# EAGLE design adsr2_v2 (EAGLE 7.1.0)
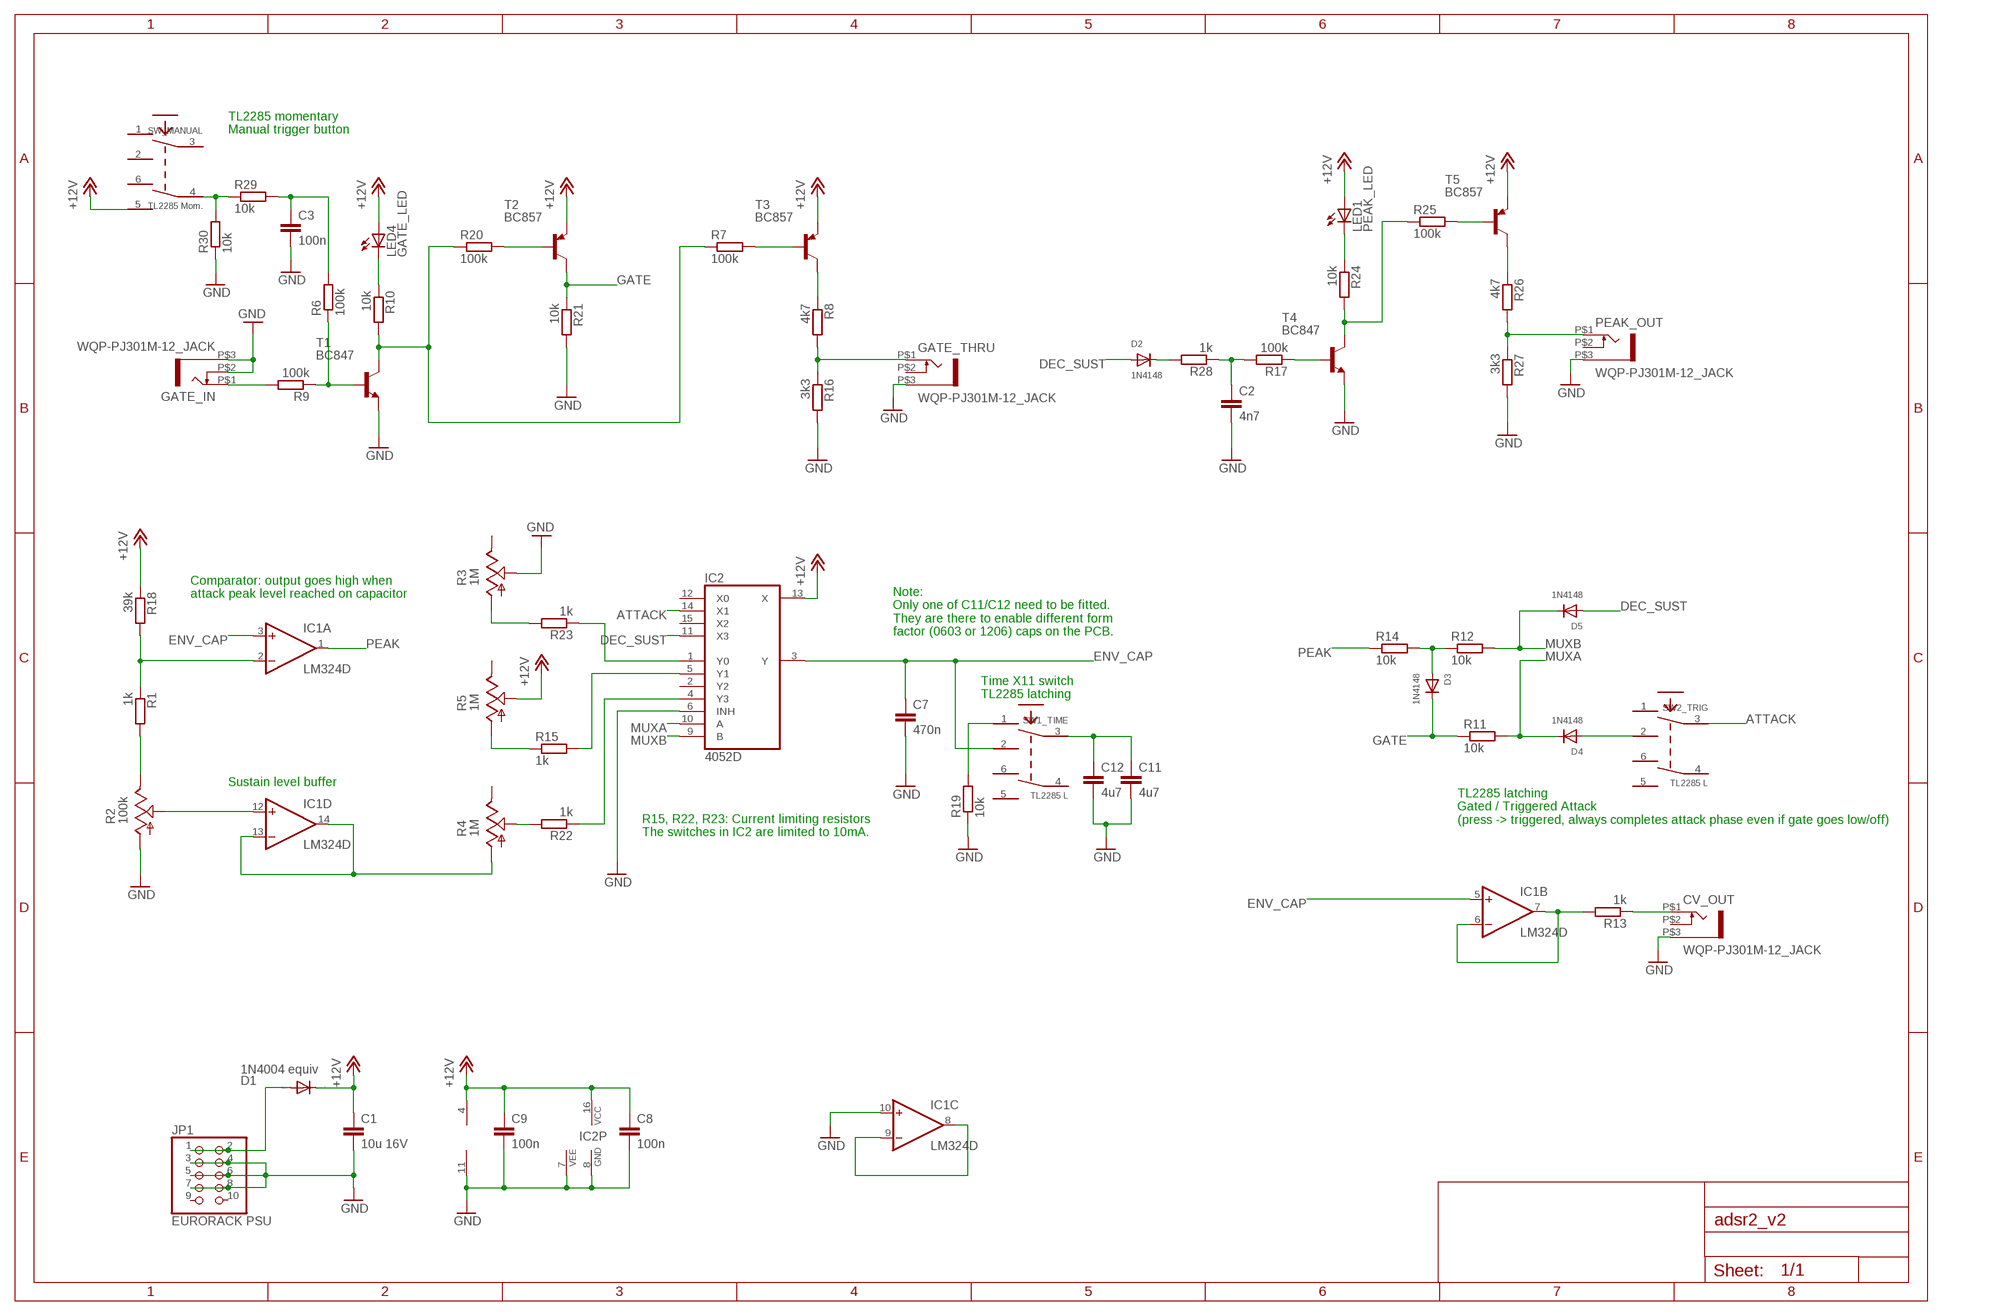
[diagram p0: schematic, sheet 1]

## Parts
C1  10u 16V  C-EUC1206K  [C1206K]
C2  4n7  C-EUC0603K  [C0603K]
C3  100n  C-EUC0603K  [C0603K]
C7  470n  C-EUC0603K  [C0603K]
C8  100n  C-EUC0603K  [C0603K]
C9  100n  C-EUC0603K  [C0603K]
C11  4u7  C-EUC1206K  [C1206K]
C12  4u7  C-EUC0603K  [C0603K]
CV_OUT  WQP-PJ301M-12_JACK  [WQP-PJ301M-12_JACK]
D1  1N4004 equiv  DIODE-DO214AA  [DO214AA]
D2  1N4148  DIODESOD-323F  [SOD-323F]
D3  1N4148  DIODESOD-323F  [SOD-323F]
D4  1N4148  DIODESOD-323F  [SOD-323F]
D5  1N4148  DIODESOD-323F  [SOD-323F]
GATE_IN  WQP-PJ301M-12_JACK  [WQP-PJ301M-12_JACK]
GATE_THRU  WQP-PJ301M-12_JACK  [WQP-PJ301M-12_JACK]
IC1  LM324D  [SO14]
IC2  4052D  [SO16]
JP1  EURORACK PSU  PINHD-2X5  [2X05]
LED1  PEAK_LED  LED5MM  [LED5MM]
LED4  GATE_LED  LED5MM  [LED5MM]
PEAK_OUT  WQP-PJ301M-12_JACK  [WQP-PJ301M-12_JACK]
R1  1k  R-EU_R0603  [R0603]
R2  100k  POT_USVERTICAL  [ALPS_POT_VERTICAL]
R3  1M  POT_USVERTICAL  [ALPS_POT_VERTICAL]
R4  1M  POT_USVERTICAL  [ALPS_POT_VERTICAL]
R5  1M  POT_USVERTICAL  [ALPS_POT_VERTICAL]
R6  100k  R-EU_R0603  [R0603]
R7  100k  R-EU_R0603  [R0603]
R8  4k7  R-EU_R0603  [R0603]
R9  100k  R-EU_R0603  [R0603]
R10  10k  R-EU_R0603  [R0603]
R11  10k  R-EU_R0603  [R0603]
R12  10k  R-EU_R0603  [R0603]
R13  1k  R-EU_R0603  [R0603]
R14  10k  R-EU_R0603  [R0603]
R15  1k  R-EU_R0603  [R0603]
R16  3k3  R-EU_R0603  [R0603]
R17  100k  R-EU_R0603  [R0603]
R18  39k  R-EU_R0603  [R0603]
R19  10k  R-EU_R0603  [R0603]
R20  100k  R-EU_R0603  [R0603]
R21  10k  R-EU_R0603  [R0603]
R22  1k  R-EU_R0603  [R0603]
R23  1k  R-EU_R0603  [R0603]
R24  10k  R-EU_R0603  [R0603]
R25  100k  R-EU_R0603  [R0603]
R26  4k7  R-EU_R0603  [R0603]
R27  3k3  R-EU_R0603  [R0603]
R28  1k  R-EU_R0603  [R0603]
R29  10k  R-EU_R0603  [R0603]
R30  10k  R-EU_R0603  [R0603]
SW1_TIME  TL2285 L  TL2285  [TL2285_PCB]
SW2_TRIG  TL2285 L  TL2285  [TL2285_PCB]
SW_MANUAL  TL2285 Mom.  TL2285  [TL2285_PCB]
T1  BC847  [SOT23]
T2  BC857  BC857A-PNP-SOT23-BEC  [SOT23-BEC]
T3  BC857  BC857A-PNP-SOT23-BEC  [SOT23-BEC]
T4  BC847  [SOT23]
T5  BC857  BC857A-PNP-SOT23-BEC  [SOT23-BEC]

## Nets
+12V: C1.1 C8.1 C9.1 D1.C IC1.4(P:V+) IC2.13(X) IC2.16(VCC) LED1.A LED4.A R5.P$2(S) R18.1 SW_MANUAL.5 T2.E T3.E T5.E
ATTACK: IC2.14(X1) SW2_TRIG.3
ATTACK_REF: IC1.2(A:-IN) R1.1 R18.2
DEC_SUST: D2.A D5.A IC2.11(X3)
ENV_CAP: C7.1 IC1.3(A:+IN) IC1.5(B:+IN) IC2.3(Y) SW1_TIME.2
GATE: D3.C R11.1 R21.1 T2.C
GATE_IN: R7.1 R10.2 R20.1 T1.3(C)
GND: C1.2 C2.2 C3.2 C7.2 C8.2 C9.2 C11.2 C12.2 CV_OUT.P$3 GATE_IN.P$2 GATE_IN.P$3 GATE_THRU.P$3 IC1.10(C:+IN) IC1.11(P:V-) IC2.6(INH) IC2.7(VEE) IC2.8(GND) JP1.3 JP1.4 JP1.5 JP1.6 JP1.7 JP1.8 PEAK_OUT.P$3 R2.P$3(A) R3.P$2(S) R16.2 R19.1 R21.2 R27.2 R30.1 T1.2(E) T4.2(E)
MUXA: D4.C IC2.10(A) R11.2
MUXB: D5.C IC2.9(B) R12.2
N$1: R20.2 T2.B
N$2: GATE_IN.P$1 R9.2
N$3: D1.A JP1.1 JP1.2
N$4: R29.1 R30.2 SW_MANUAL.4
N$5: IC2.1(Y0) R23.1
N$6: IC2.4(Y3) R22.1
N$7: IC1.13(D:-IN) IC1.14(D:OUT) R4.P$3(A)
N$8: R7.2 T3.B
N$9: R8.1 T3.C
N$10: IC2.5(Y1) R15.2
N$11: CV_OUT.P$1 R13.1
N$12: IC1.6(B:-IN) IC1.7(B:OUT) R13.2
N$13: GATE_THRU.P$1 R8.2 R16.1
N$14: D2.C R28.2
N$15: C3.1 R6.2 R29.2
N$16: C11.1 C12.1 SW1_TIME.3
N$17: D3.A R12.1 R14.2
N$18: R19.2 SW1_TIME.1
N$19: R17.1 T4.1(B)
N$20: C2.1 R17.2 R28.1
N$21: R6.1 R9.1 T1.1(B)
N$22: LED4.K(C) R10.1
N$23: R3.P$3(A) R23.2
N$24: IC1.8(C:OUT) IC1.9(C:-IN)
N$25: R5.P$3(A) R15.1
N$26: R1.2 R2.P$1(E)
N$27: D4.A SW2_TRIG.2
N$28: R4.P$2(S) R22.2
N$30: R24.2 R25.1 T4.3(C)
N$31: LED1.K(C) R24.1
N$33: R25.2 T5.B
N$34: R26.1 T5.C
N$35: PEAK_OUT.P$1 R26.2 R27.1
PEAK: IC1.1(A:OUT) R14.1
SUST_LEVEL: IC1.12(D:+IN) R2.P$2(S)
Unconnected: CV_OUT.P$2 GATE_THRU.P$2 IC2.2(Y2) IC2.12(X0) IC2.15(X2) JP1.9 JP1.10 PEAK_OUT.P$2 R3.P$1(E) R4.P$1(E) R5.P$1(E) SW1_TIME.4 SW1_TIME.5 SW1_TIME.6 SW2_TRIG.1 SW2_TRIG.4 SW2_TRIG.5 SW2_TRIG.6 SW_MANUAL.1 SW_MANUAL.2 SW_MANUAL.3 SW_MANUAL.6

## Notes on the sheet
- TL2285 momentary
  Manual trigger button
- Comparator: output goes high when
  attack peak level reached on capacitor
- Note:
  Only one of C11/C12 need to be fitted.
  They are there to enable different form
  factor (0603 or 1206) caps on the PCB.
- Time X11 switch
  TL2285 latching
- Sustain level buffer
- TL2285 latching
  Gated / Triggered Attack
  (press -> triggered, always completes attack phase even if gate goes low/off)
- R15, R22, R23: Current limiting resistors
  The switches in IC2 are limited to 10mA.

## Library data of the parts
C1-C3 C7-C9 C11 C12 = rcl:C-EU: CAPACITOR, European symbol
CV_OUT GATE_IN GATE_THRU PEAK_OUT = thonkiconn:WQP-PJ301M-12_JACK
D1 = diode:DIODE-: DIODE
D2-D5 = adafruit:DIODE: Diode SMADIODE - SMA Surface Mount Package 20V 1A Schottky Diode Digikey: 641-1014-6-ND DO-1N4148 - Through Hole Small Current Diode SOD-123 20V 1 A (.5mV Vf) Schottky Diode - Digikey: MBRX120TPMSCT-ND SOD-323 10V 570mA (.38mV Vf, 3ns) Schottky Diode - Digikey: ZLLS410CT-ND SOD-523 30V 30mA Schottky Diode (RB751S-40TE61) - Digikey: RB751S-40TE61CT-ND SOT23-R/W - SOT23 Package (R = Solder Paste/Reflow Ovens, W = Hand-Soldering) BAT54Film 40V 300mA - Digikey: 497-7162-1-ND
IC1 = linear:LM324: OP AMP
IC2 = 40xx:4052: Dual 4-channel ANALOG MULTIPLEXER
JP1 = pinhead:PINHD-2X5: PIN HEADER
LED1 LED4 = led:LED: LED OSRAM: - CHIPLED LG R971, LG N971, LY N971, LG Q971, LY Q971, LO R971, LY R971 LH N974, LH R974 LS Q976, LO Q976, LY Q976 LO Q996 - Hyper CHIPLED LW Q18S LB Q993, LB Q99A, LB R99A - SideLED LS A670, LO A670, LY A670, LG A670, LP A670 LB A673, LV A673, LT A673, LW A673 LH A674 LY A675 LS A676, LA A676, LO A676, LY A676, LW A676 LS A679, LY A679, LG A679 - Hyper Micro SIDELED® LS Y876, LA Y876, LO Y876, LY Y876 LT Y87S - SmartLED LW L88C, LW L88S LB L89C, LB L89S, LG L890 LS L89K, LO L89K, LY L89K LS L896, LA L896, LO L896, LY L896 - TOPLED LS T670, LO T670, LY T670, LG T670, LP T670 LSG T670, LSP T670, LSY T670, LOP T670, LYG T670 LG T671, LOG T671, LSG T671 LB T673, LV T673, LT T673, LW T673 LH T674 LS T676, LA T676, LO T676, LY T676, LB T676, LH T676, LSB T676, LW T676 LB T67C, LV T67C, LT T67C, LS T67K, LO T67K, LY T67K, LW E67C LS E67B, LA E67B, LO E67B, LY E67B, LB E67C, LV E67C, LT E67C LW T67C LS T679, LY T679, LG T679 LS T770, LO T770, LY T770, LG T770, LP T770 LB T773, LV T773, LT T773, LW T773 LH T774 LS E675, LA E675, LY E675, LS T675 LS T776, LA T776, LO T776, LY T776, LB T776 LHGB T686 LT T68C, LB T68C - Hyper Mini TOPLED® LB M676 - Mini TOPLED Santana® LG M470 LS M47K, LO M47K, LY M47K Source: http://www.osram.convergy.de LUXEON: - LUMILED® LXK2-PW12-R00, LXK2-PW12-S00, LXK2-PW14-U00, LXK2-PW14-V00 LXK2-PM12-R00, LXK2-PM12-S00, LXK2-PM14-U00 LXK2-PE12-Q00, LXK2-PE12-R00, LXK2-PE12-S00, LXK2-PE14-T00, LXK2-PE14-U00 LXK2-PB12-K00, LXK2-PB12-L00, LXK2-PB12-M00, LXK2-PB14-N00, LXK2-PB14-P00, LXK2-PB14-Q00 LXK2-PR12-L00, LXK2-PR12-M00, LXK2-PR14-Q00, LXK2-PR14-R00 LXK2-PD12-Q00, LXK2-PD12-R00, LXK2-PD12-S00 LXK2-PH12-R00, LXK2-PH12-S00 LXK2-PL12-P00, LXK2-PL12-Q00, LXK2-PL12-R00 Source: www.luxeon.com KINGBRIGHT: KA-3528ASYC Source: www.kingbright.com
R1 R6-R30 = rcl:R-EU_: RESISTOR, European symbol
R2-R5 = pot-alps:POT_US
SW1_TIME SW2_TRIG SW_MANUAL = lb_devs:TL2285: E-Switch TL2285 (PCB switch)
T1 T4 = transistor:BC847: NPN TRANSISTOR
T2 T3 T5 = transistor:*-PNP-: PNP Transistror

## Board
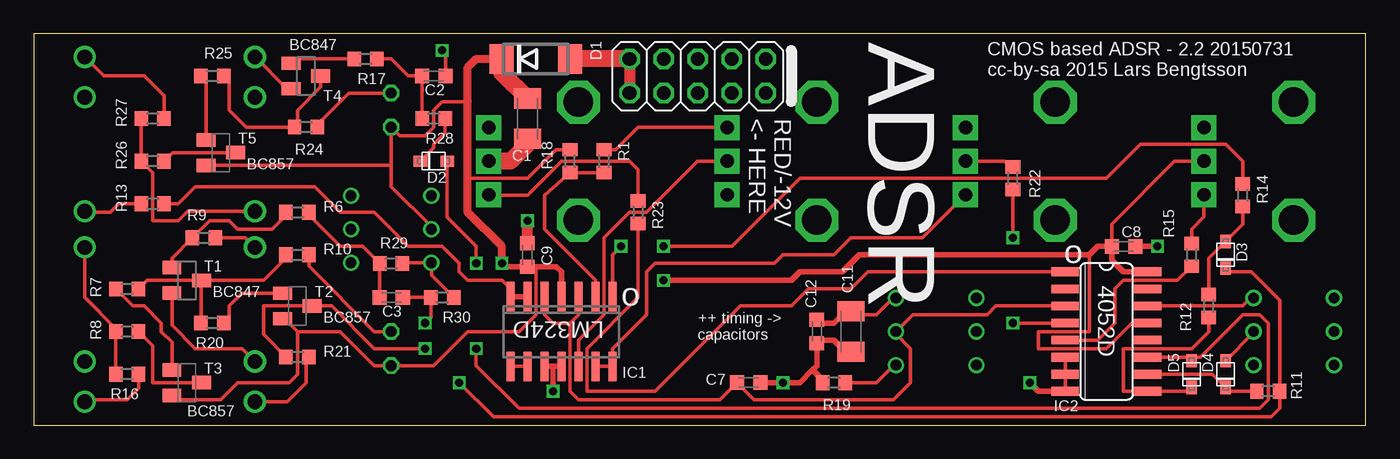
[diagram p1: board, top side]
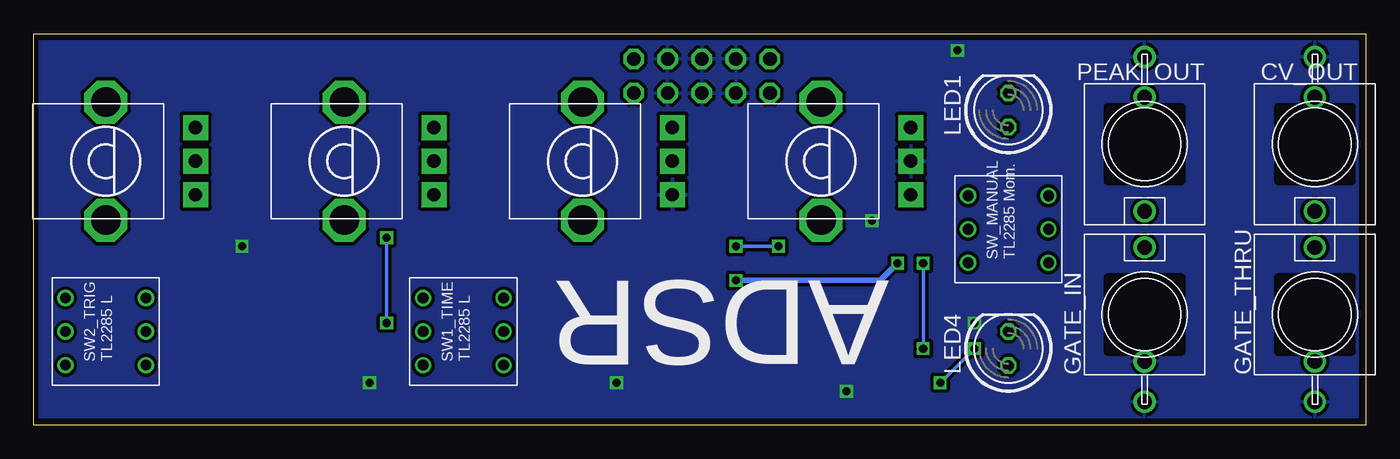
[diagram p2: board, bottom side, seen from below]

Size 99.36 x 29.2 mm. Coordinates in mm from the lower left corner, seen from the top.
Outline: 0,0 99.36,0 99.36,29.2 0,29.2 0,0
Copper layers (1*16): Top 0.0356mm / dielectric 1.5011mm / Bottom 0.0356mm
Design rules "LaenPCBOrder *": minimum track width 6mil, minimum drill 13mil, track to track 6mil, track to pad 6mil, pad to pad 6mil, via to via 6mil, smd to smd 6mil, copper to edge 15mil, drill to drill 6mil, minimum pad ring 7mil, minimum via ring 7mil, stop-mask expansion 3mil, vias tented up to drill 0mil, thermal gap 10mil

### Footprints (pad centres in the part's own frame; a part is rotated, then mirrored left to right if it is on the bottom)
C1206K = smd 1.5 x 2: 1 -1.5,0; 2 1.5,0
C0603K = smd 1.05 x 1.08: 1 -0.875,0; 2 0.875,0
WQP-PJ301M-12_JACK = drill 1.1: P$1 0,5; P$2 0,-3.5; P$3 0,-6.5
DO214AA = smd 1.8 x 2.2: A 2.55,0; C -2.55,0
SOD-323F = smd 1 x 0.8: A -1,0; C 1,0
SO14 = smd 0.6 x 2.2: 1 -3.81,-2.6; 2 -2.54,-2.6; 3 -1.27,-2.6; 4 0,-2.6; 5 1.27,-2.6; 6 2.54,-2.6; 7 3.81,-2.6; 8 3.81,2.6; 9 2.54,2.6; 10 1.27,2.6; 11 0,2.6; 12 -1.27,2.6; 13 -2.54,2.6; 14 -3.81,2.6
SO16 = smd 0.66 x 2.032: 1 -4.445,-3.073; 2 -3.175,-3.073; 3 -1.905,-3.073; 4 -0.635,-3.073; 5 0.635,-3.073; 6 1.905,-3.073; 7 3.175,-3.073; 8 4.445,-3.073; 9 4.445,3.073; 10 3.175,3.073; 11 1.905,3.073; 12 0.635,3.073; 13 -0.635,3.073; 14 -1.905,3.073; 15 -3.175,3.073; 16 -4.445,3.073
2X05 = drill 1.016 octagon: 1 -5.08,-1.27; 2 -5.08,1.27; 3 -2.54,-1.27; 4 -2.54,1.27; 5 0,-1.27; 6 0,1.27; 7 2.54,-1.27; 8 2.54,1.27; 9 5.08,-1.27; 10 5.08,1.27
LED5MM = drill 0.813 octagon: A -1.27,0; K 1.27,0
R0603 = smd 1 x 1.1: 1 -0.85,0; 2 0.85,0
ALPS_POT_VERTICAL = drill 1 pad 1.88 square: P$1 -2.5,6.7; P$2 0,6.7; P$3 2.5,6.7 | drill 2.2 pad 3.175 octagon: P$4 -4.4,0; P$5 4.4,0
TL2285_PCB = drill 0.8: 1 -2.5,-3; 2 0,-3; 3 2.5,-3; 4 -2.5,3; 5 0,3; 6 2.5,3
SOT23 = smd 1 x 1.4: 1 -0.95,-1.1; 2 0.95,-1.1; 3 0,1.1
SOT23-BEC = smd 1 x 1.4: B -0.95,-1.1; C 0,1.1; E 0.95,-1.1

### Placement (x,y rotation side)
C1  36.83,22.86 270 top
C2  29.84,26.03 0 top
C3  26.67,9.53 0 top
C7  53.34,3.18 0 top
C8  81.28,13.33 0 top
C9  36.83,12.7 90 top
C11  60.96,6.99 270 top
C12  58.42,6.99 270 top
CV_OUT  3.81,20.95 180 bottom
D1  37.47,27.3 0 top
D2  29.84,19.69 180 top
D3  88.9,12.7 270 top
D4  88.9,3.81 270 top
D5  86.36,3.81 270 top
GATE_IN  16.51,8.26 0 bottom
GATE_THRU  3.81,8.26 0 bottom
IC1  39.37,6.99 180 top
IC2  80.01,6.99 270 top
JP1  49.53,26.03 0 top
LED1  26.67,23.49 90 bottom
LED4  26.67,5.72 90 bottom
PEAK_OUT  16.51,20.95 180 bottom
R1  42.55,19.69 90 top
R2  58.42,19.69 270 bottom
R3  40.64,19.69 270 bottom
R4  76.2,19.69 270 bottom
R5  93.98,19.69 270 bottom
R6  19.68,15.88 0 top
R7  6.99,10.16 180 top
R8  6.99,6.99 180 top
R9  12.7,13.97 0 top
R10  19.68,12.7 180 top
R11  92.08,2.54 180 top
R12  87.63,8.89 270 top
R13  8.89,16.51 0 top
R14  90.17,17.15 270 top
R15  86.36,12.7 270 top
R16  6.99,3.81 0 top
R17  24.77,27.3 0 top
R18  40.01,19.69 270 top
R19  59.69,3.18 0 top
R20  13.34,7.62 0 top
R21  19.68,5.08 0 top
R22  73.03,18.41 90 top
R23  45.09,15.88 90 top
R24  20.32,22.23 180 top
R25  13.34,26.03 180 top
R26  8.89,19.69 180 top
R27  8.89,22.86 0 top
R28  29.84,22.86 0 top
R29  26.67,12.06 180 top
R30  30.48,9.53 0 top
SW1_TIME  67.31,6.99 90 bottom
SW2_TRIG  93.98,6.99 90 bottom
SW_MANUAL  26.67,14.6 90 bottom
T1  11.43,10.79 270 top
T2  19.68,8.89 270 top
T3  11.43,3.18 270 top
T4  20.32,26.03 270 top
T5  13.97,20.32 270 top

### Tracks (layer width: path | path; a pad name or v marks a point on that pad's centre or on a via)
+12V  (via drill 0.6)
  Top 0.254: T2.E 18.73,7.94 19.68,6.99 | 19.68,6.99 22.86,6.99 25.4,4.45 LED4.A 29.84,4.45 32.38,6.99 36.2,6.99 37.47,8.26 37.47,11.83 | 19.68,6.99 19.68,3.81 19.05,3.18 15.24,3.18 13.97,1.9 10.65,1.9 T3.E | T5.E 26.67,19.37 | IC2.13 81.92,7.62 80.01,5.72 74.93,5.72 74.93,6.99 78.74,6.99 78.74,12.7 | C8.1 80.41,15 85.09,19.69 R5.P$2 | SW_MANUAL.5 29.67,14.78 26.67,17.78 26.67,19.37 | 26.67,19.37 LED1.A 27.3,21.59 29.21,21.59 29.84,22.23 29.84,23.49 30.48,24.13 32.38,24.13 | R18.1 38.95,20.53 36.83,18.41 32.38,18.41
  Top 0.406: v34.92,12.06 35.16,11.83 C9.1 37.47,11.83 38.98,11.83 39.37,11.43 IC1.4 | v46.99,10.79 56.52,10.79 57.15,11.43 60.33,11.43 61.59,12.7 78.74,12.7 79.38,13.33 C8.1 80.41,12.31 81.28,11.43 IC2.16
  Top 0.61: v34.92,12.06 34.92,13.33 32.38,15.88 32.38,18.41 32.38,24.13 32.38,26.67 33.02,27.3 D1.C
  Top 1.27: D1.C 34.91,26.27 C1.1
  Bottom 0.406: v34.92,12.06 36.2,10.79 v46.99,10.79
ATTACK
  Top 0.254: SW2_TRIG.3 90.77,9.49 90.17,8.89 IC2.14
ATTACK_REF
  Top 0.254: R1.1 R18.2 38.1,17.15 38.1,14.6 41.91,10.79 IC1.2
DEC_SUST  (via drill 0.6)
  Top 0.254: IC2.11 86.09,5.08 D5.A | D2.A 30.84,15.51 33.02,13.33 v33.02,12.06 | 86.36,4.45 D5.A | v33.02,5.72 33.02,4.45 36.2,1.27 91.44,1.27 92.08,1.9 92.08,7.62 91.44,8.26 90.17,8.26 87,5.08 86.36,5.08 D5.A
  Bottom 0.254: v33.02,12.06 v33.02,5.72
ENV_CAP
  Top 0.254: IC1.5 38.1,8.26 38.73,7.62 40.01,7.62 | IC1.3 40.64,8.26 40.01,7.62 | 40.01,7.62 40.01,2.54 40.64,1.9 51.2,1.9 C7.1 53.73,1.9 64.14,1.9 65.41,3.18 65.41,5.72 64.31,6.81 SW1_TIME.2 65.58,8.26 71.12,8.26 71.75,8.89 IC2.3
GATE  (via drill 0.6)
  Top 0.254: R21.1 17.14,6.77 17.14,8.89 T2.C 22.23,8.89 25.4,5.72 v29.21,5.72 | v31.75,3.18 34.29,0.63 92.29,0.63 92.92,1.27 R11.1 92.92,9.31 90.81,11.43 89.17,11.43 D3.C
  Bottom 0.254: v29.21,5.72 v31.75,3.18
GATE_IN
  Top 0.254: R10.2 18.84,12.49 17.14,10.79 T1.3 | R20.1 12.48,10.75 T1.3 | T1.3 8.47,10.79 R7.1
GND  (via drill 0.6)
  Top 0.254: GATE_IN.P$3 18.9,1.76 20.32,3.18 20.32,4.87 R21.2 | T1.2 10.33,7.45 12.06,5.72 15.55,5.72 GATE_IN.P$2 | R27.2 9.74,24.55 8.26,26.03 5.23,26.03 CV_OUT.P$3 | IC2.6 IC2.7 IC2.8 | R16.2 7.83,2.76 6.99,1.9 3.96,1.9 GATE_THRU.P$3 | T4.2 18.88,25.09 PEAK_OUT.P$3 | C2.2 30.72,27.7 v30.48,27.94 | C3.2 R30.1 29.63,8.04 v29.21,7.62
  Top 0.406: IC1.10 38.73,4.38 | 38.73,4.38 IC1.11 | IC2.8 74.93,2.54 v74.3,3.18 | C7.2 v55.88,3.18 57.15,3.18 58.1,4.13 | 58.1,4.13 58.42,4.45 C12.2 58.66,6.35 59.69,6.35 60.55,5.49 C11.2 | R19.1 58.84,3.39 58.1,4.13 | v83.82,13.33 C8.2 | v38.73,2.54 38.73,4.38
  Top 0.813: C9.2 v36.83,15.24
  Top 1.27: C1.2 36.83,20.95 35.56,19.69 R3.P$2
  pour Bottom (isolate 0.254): 0.64,28.57 99.06,28.57 99.06,0.63 0.64,0.63
MUXA
  Top 0.254: IC2.10 87.9,3.81 D4.C 89.17,2.54 R11.2
MUXB
  Top 0.254: D5.C 86.09,2.54 IC2.9 81.28,2.54 81.28,5.72 86.36,5.72 87.63,6.99 R12.2
N$1
  Top 0.254: T2.B 15.55,9.84 14.61,8.89 14.61,8.04 R20.2
N$2
  Top 0.254: R9.2 15.79,13.97 GATE_IN.P$1
N$3
  Top 0.813: JP1.2 JP1.1
  Top 1.27: JP1.2 D1.A
N$4
  Top 0.254: R29.1 27.56,12.1 SW_MANUAL.4 29.67,11.19 R30.2
N$5
  Top 0.254: IC2.1 62.23,11.43 60.96,10.16 57.78,10.16 56.52,8.89 52.7,8.89 46.35,2.54 41.27,2.54 41.27,5.72 45.09,9.53 R23.1
N$6  (via drill 0.6)
  Top 0.254: v73.03,7.62 IC2.4 | R22.1 v73.03,13.97
  Bottom 0.254: v73.03,13.97 v73.03,7.62
N$7
  Top 0.254: IC1.13 IC1.14 | 43.18,3.81 IC1.14 | IC1.14 43.18,5.72 45.72,8.26 45.72,11.43 46.35,12.06 55.24,12.06 55.88,12.7 59.69,12.7 60.96,13.97 66.28,13.97 R4.P$3
N$8
  Top 0.254: T3.B 10.33,6.18 9.53,6.99 9.53,7.62 8.26,8.89 7.41,8.89 R7.2
N$9
  Top 0.254: T3.C 8.89,3.18 8.89,5.93 R8.1
N$10
  Top 0.254: IC2.5 79.38,6.35 80.64,7.62 80.64,10.16 81.28,10.79 85.31,10.79 R15.2
N$11
  Top 0.254: R13.1 6.35,16.51 5.71,15.88 3.89,15.88 CV_OUT.P$1
N$12
  Top 0.254: R13.2 10.79,16.51 12.06,17.78 20.95,17.78 22.86,15.88 25.4,15.88 27.94,13.33 30.48,13.33 31.75,12.06 31.75,11.43 32.38,10.79 34.92,10.79 35.56,10.16 IC1.7 35.5,9.53
  Top 0.406: IC1.7 IC1.6
N$13
  Top 0.254: R16.1 R8.2 6.13,7.2 3.81,9.53 GATE_THRU.P$1
N$14
  Top 0.254: R28.2 30.7,21.8 29.84,20.95 29.84,20.69 D2.C
N$15
  Top 0.254: R6.2 20.54,15.66 22.86,13.33 24.55,13.33 R29.2 25.82,9.55 C3.1
N$16
  Top 0.254: SW1_TIME.3 64.09,9.49 62.87,8.26 61.19,8.26 C11.1
  Top 0.406: C11.1 60.55,8.49 59.69,7.62 58.66,7.62 C12.1
N$17
  Top 0.254: R12.1 87.63,12.43 D3.A 90.17,14.97 R14.2
N$18
  Top 0.254: SW1_TIME.1 64.17,4.48 62.87,3.18 R19.2
N$19
  Top 0.254: R17.1 19.54,27.3 T4.1
N$20
  Top 0.254: 28.84,25.91 C2.1 | C2.1 27.94,26.03 26.67,27.3 R17.2 | R28.1 29,26.01 C2.1
N$21
  Top 0.254: T1.1 10.33,12.45 R9.1 13.12,15.24 14.61,15.24 15.24,14.6 17.78,14.6 18.84,15.66 R6.1
N$22
  Top 0.254: R10.1 20.54,11.85 25.4,6.99 LED4.K
N$23
  Top 0.254: R23.2 45.09,19.05 44.45,19.69 39.37,19.69 36.83,17.15 33.98,17.15 R3.P$3
N$24
  Top 0.254: IC1.9 IC1.8
N$25
  Top 0.254: R5.P$3 87.28,15.53 86.36,14.6 R15.1
N$26
  Top 0.254: R1.2 43.4,20.53 45.09,22.23 51.68,22.23 R2.P$1
N$27
  Top 0.254: SW2_TRIG.2 90.98,6.89 D4.A
N$28
  Top 0.254: R22.2 72.81,19.27 72.39,19.69 R4.P$2
N$30
  Top 0.254: R25.1 14.61,25.61 14.61,23.49 15.88,22.23 R24.2 19.68,22.44 19.68,23.49 21.42,25.23 T4.3
N$31
  Top 0.254: R24.1 21.17,22.44 23.5,24.77 LED1.K
N$33
  Top 0.254: T5.B 12.87,25.65 R25.2
N$34
  Top 0.254: T5.C 10.38,20.32 R26.1
N$35
  Top 0.254: R27.1 R26.2 8.89,18.84 8.89,15.24 10.79,15.24 11.51,15.96 PEAK_OUT.P$1
PEAK  (via drill 0.6)
  Top 0.254: v43.81,13.33 43.18,12.7 IC1.1 | R14.1 90.17,19.69 88.9,20.95 82.55,20.95 80.01,18.41 57.15,18.41 52.07,13.33 v46.99,13.33
  Bottom 0.254: v46.99,13.33 v43.81,13.33
SUST_LEVEL
  Top 0.254: IC1.12 40.64,6.35 42.55,8.26 42.55,13.97 44.45,15.88 45.72,15.88 49.53,19.69 R2.P$2

### Text on the board
tNames: ADSR | CMOS based ADSR - 2.2 20150731 / cc-by-sa 2015 Lars Bengtsson | RED/-12V / <- HERE | o | o | ++ timing -> / capacitors
bNames: ADSR